# Altium schematic sheet Debug.SchDoc
size A4; SheetNumber: 11; SheetTotal: 13
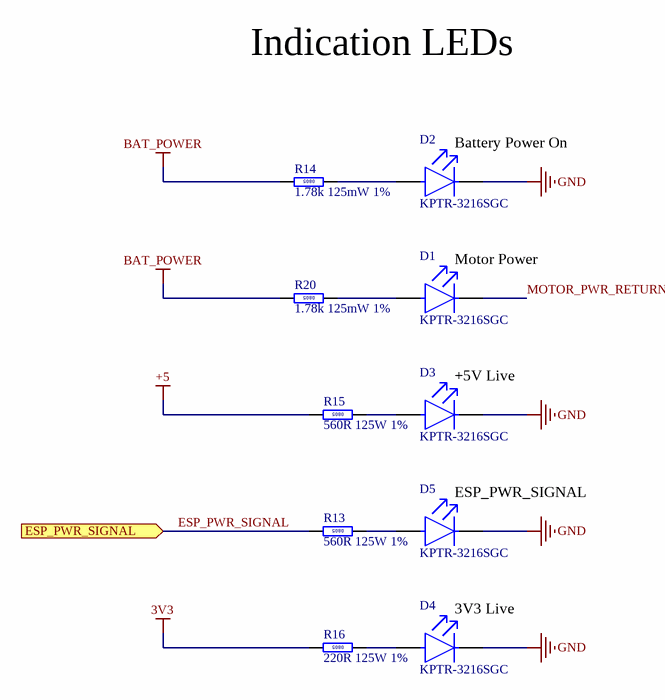
[diagram p0: Debug.SchDoc]

## Parts
D1  KPTR-3216SGC  [KPTR-3216SGC-Footprint-1]
D2  KPTR-3216SGC  [KPTR-3216SGC-Footprint-1]
D3  KPTR-3216SGC  [KPTR-3216SGC-Footprint-1]
D4  KPTR-3216SGC  [KPTR-3216SGC-Footprint-1]
D5  KPTR-3216SGC  [KPTR-3216SGC-Footprint-1]
R13  560R 125W 1%  [RESC2013X60X35LL10T20]
R14  1.78k 125mW 1%  [RESC2013X60X35LL10T20]
R15  560R 125W 1%  [RESC2013X60X35LL10T20]
R16  220R 125W 1%  [RESC2013X60X35LL10T20]
R20  1.78k 125mW 1%  [RESC2013X60X35LL10T20]

## Ports
ESP_PWR_SIGNAL (in)

## Nets
3V3: R16.2
+5: R15.2
BAT_POWER: R14.2 R20.2
GND: D2.2(C) D3.2(C) D4.2(C) D5.2(C)
ESP_PWR_SIGNAL: R13.2 ; port ESP_PWR_SIGNAL
MOTOR_PWR_RETURN: D1.2(C)
NetD1_1: D1.1(A) R20.1
NetD2_1: D2.1(A) R14.1
NetD3_1: D3.1(A) R15.1
NetD4_1: D4.1(A) R16.1
NetD5_1: D5.1(A) R13.1

## Notes on the sheet
- Indication LEDs
- (near D2) Battery Power On
- (near D1) Motor Power
- (near D3) +5V Live
- (near D5) ESP_PWR_SIGNAL
- (near D4) 3V3 Live

## Library data of the parts
D1-D5 = CMP-40-060-00012-7: Single Color LED, Super Bright Green, Water Clear, 1.6mm; Manufacturer: Kingbright; Reverse Voltage-Max: 5V; Overall Height: 1.05mm; Channels: 1; Luminous Intensity-Nom: 15mcd; Forward Voltage: 2.5V; Shape: Rectangular; Luminous Intensity-Min: 120cd; Viewing Angle: 120°; Forward Current: 25mA; ComponentLinkDescription: Datasheet; Terminal Pitch: 3.6mm; Size: 1.6mm; Colour: Super Bright Green; Min Operating Temperature: -40°C; Max Operating Temperature: 85°C; Package: 1206; ComponentLinkURL: https://datasheet.ciiva.com/pdfs/VipMasterIC/IC/KNGB/KNGBS03251/KNGBS03251-1.pdf?src-supplier=IHS+Markit; RoHS Compliant: Yes; Color@wavelength: Green; Maximum Operating Temperature: 85°C; Packaging: Tape and Reel; Minimum Operating Temperature: -40°C; ManufacturerPartNumber: KPTR-3216SGC; Pins: 2; Optoelectronic Device Type: SINGLE COLOR LED; Color: Green; MountingType: SMD; Reach SVHC Compliant: Yes; ForwardVoltage: 2.5V; Lens Style: WATER CLEAR; Mounting Technology: Surface Mount
R13 R15 R16 = CMP-40-025-00230-1: Res, SMD, 560R, 125mW, 1%, ±100ppm, 0805; Manufacturer: Panasonic; ManufacturerPartNumber: ERJ-6ENF5600V; Package Height: 0.6; ComponentLinkDescription: Datasheet; Voltage Rating: 150V; Resistance: 560; Max Operating Temperature: 155°C; Tolerance: 1%; Composition: Thick Film; Min Operating Temperature: -55°C; ComponentLinkURL: https://octopart.com/erj-6enf5600v-panasonic-55477609; RoHS3Compliant: Yes (with excemption); Case/Package: 0805; Mount: SMD; Contact Plating: Tin; RoHS3Certificate: https://download.siliconexpert.com/pdfs2/2024/6/2/9/59/48/925943/pns_/manual/erj6enf2700v_rohs.pdf; Number of Pins: 2; Power Rating: 125mW; Temperature Coefficient (ppm/cel): ±100ppm; Reach SVHC Compliant: Unaffected; Resistor Type: Fixed
R14 R20 = CMP-40-025-00237-1: Res, SMD, 1.78k, 125mW, 1%, ±100ppm, 0805; Manufacturer: Panasonic; ManufacturerPartNumber: ERJ-6ENF1781V; ComponentLinkDescription: Datasheet; Voltage Rating: 150V; Package Height: 0.6mm; Power Rating: 125mW; Composition: Thick Film; RoHS3Compliant: Yes (with excemption); Number of Pins: 2; Resistance: 1.78k; Reach SVHC Compliant: Unaffected; Case/Package: 0805; Max Operating Temperature: 155°C; Mount: SMD; Resistor Type: Fixed; ComponentLinkURL: https://octopart.com/part/panasonic/ERJ-6ENF1781V; Min Operating Temperature: -55°C; Temperature Coefficient (ppm/cel): ±100ppm; Contact Plating: Tin; Tolerance: 1%